# EAGLE design NTP GPS V1.0 (EAGLE 7.7.0)
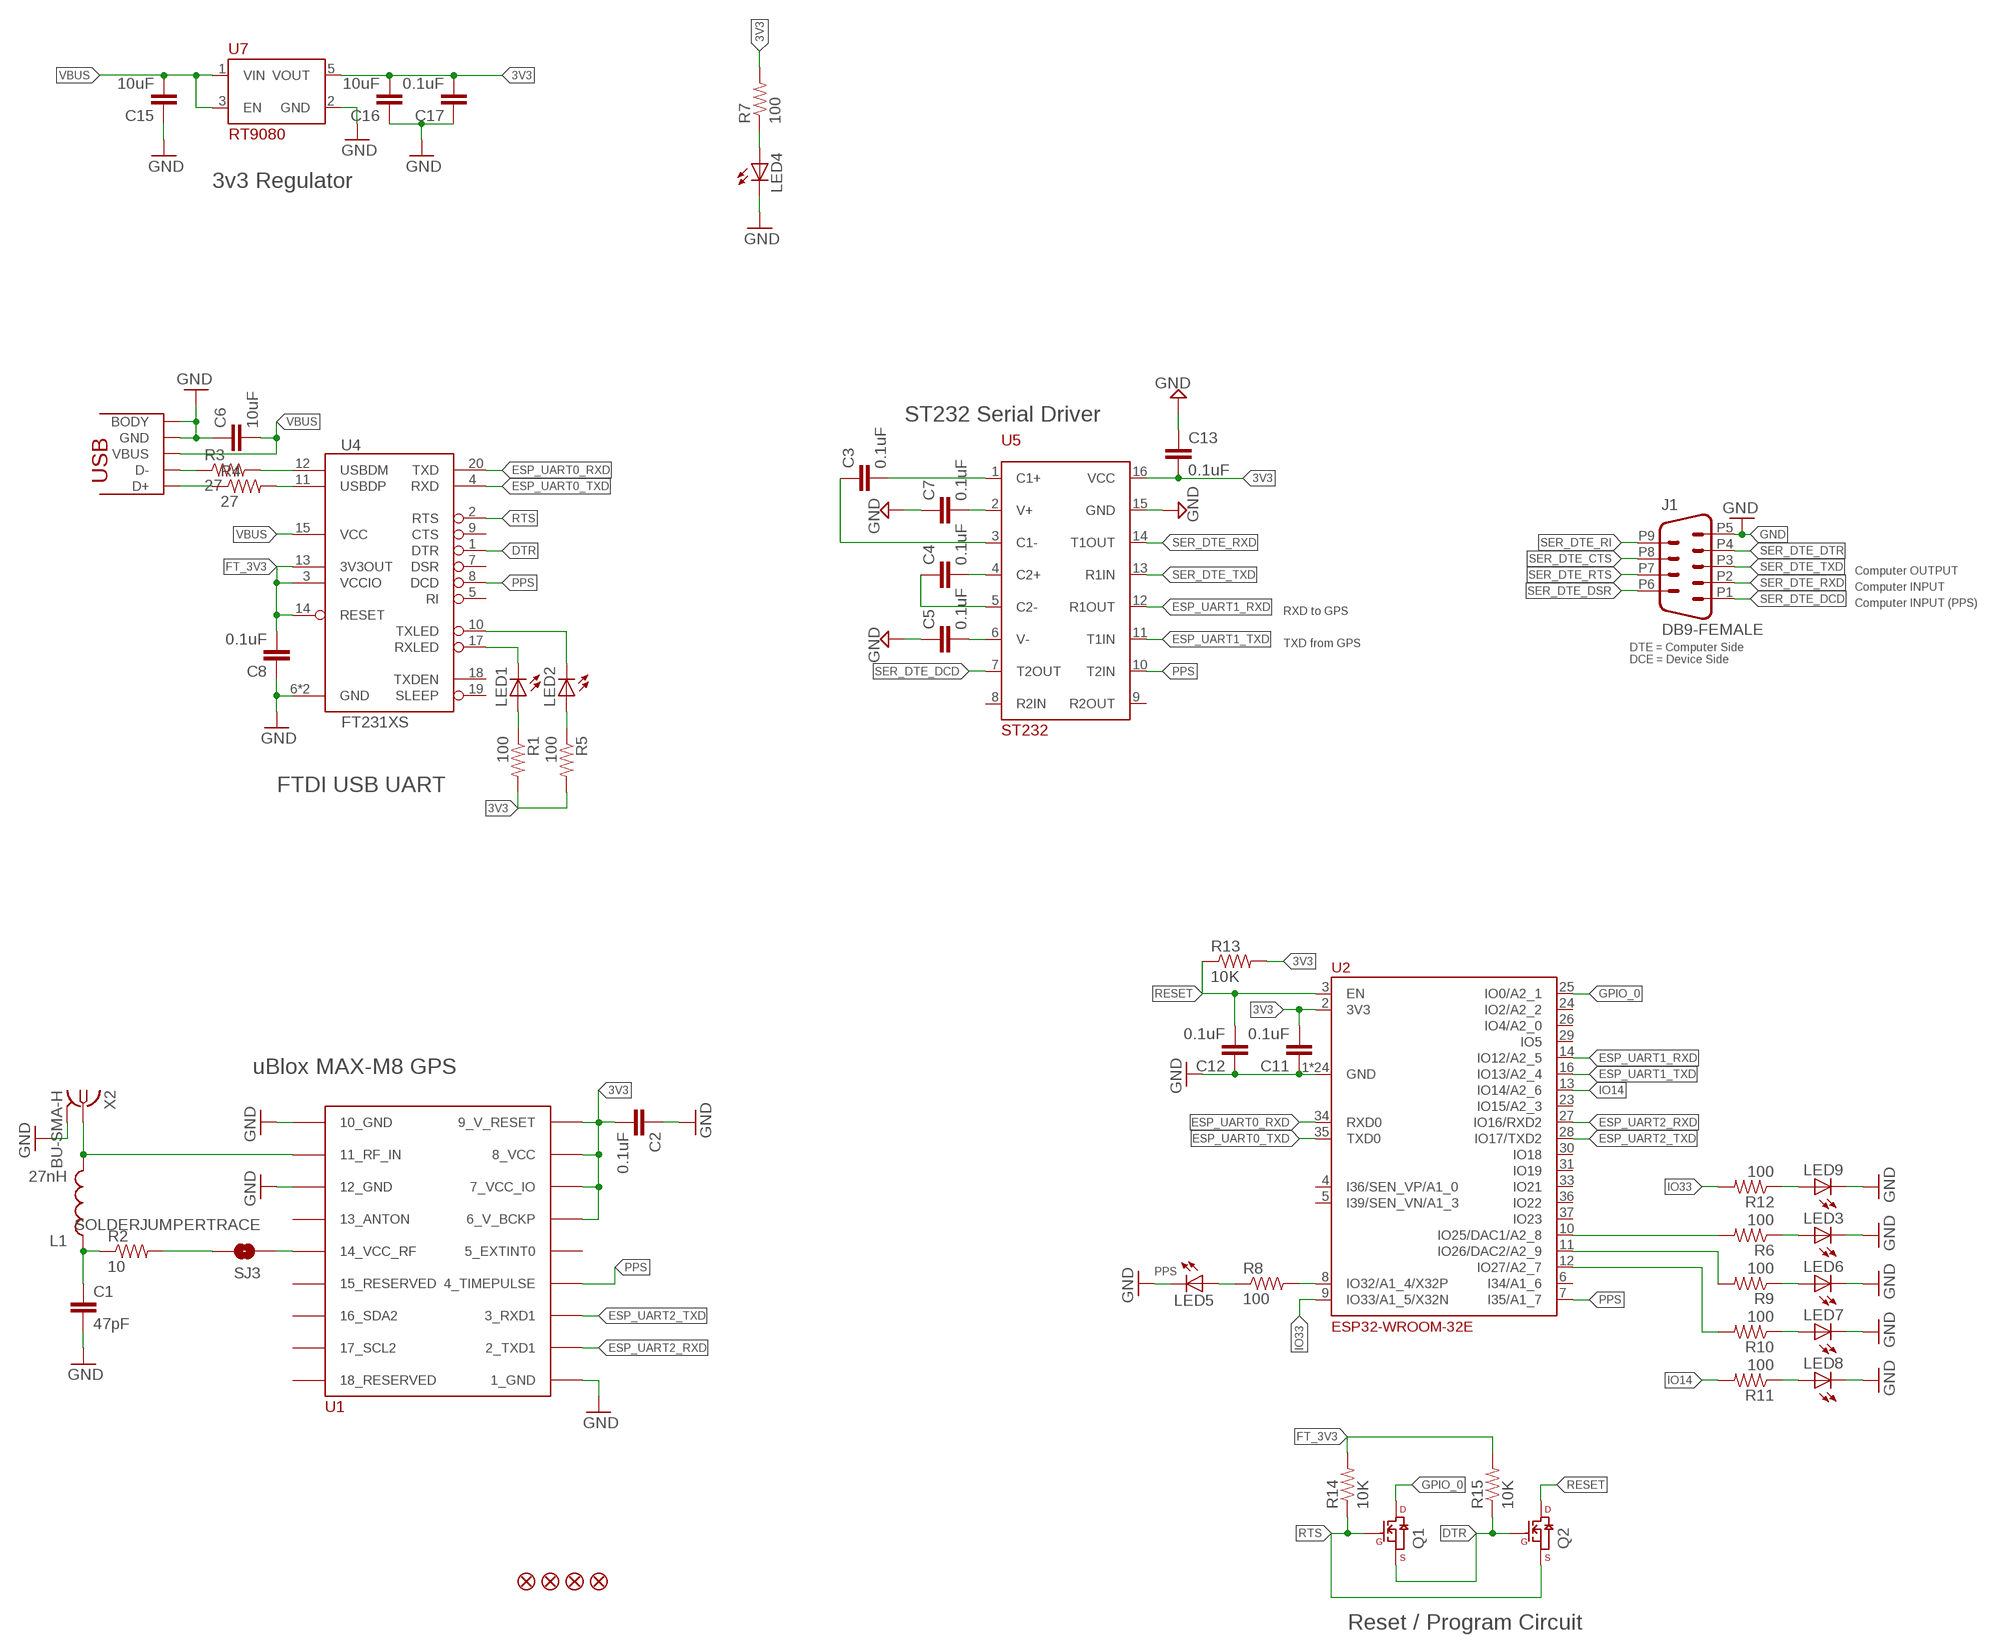
[diagram p0: schematic, sheet 1]

## Parts
C1  47pF  CAP0603-CAP  [0603-CAP]
C2  0.1uF  CAP0603-CAP  [0603-CAP]
C3  0.1uF  CAP0603-CAP  [0603-CAP]
C4  0.1uF  CAP0603-CAP  [0603-CAP]
C5  0.1uF  CAP0603-CAP  [0603-CAP]
C6  10uF  CAP1206  [1206]
C7  0.1uF  CAP0603-CAP  [0603-CAP]
C8  0.1uF  CAP0603-CAP  [0603-CAP]
C11  0.1uF  CAP0603-CAP  [0603-CAP]
C12  0.1uF  CAP0603-CAP  [0603-CAP]
C13  0.1uF  CAP0603-CAP  [0603-CAP]
C15  10uF  CAP1206  [1206]
C16  10uF  CAP1206  [1206]
C17  0.1uF  CAP0603-CAP  [0603-CAP]
FID1  FIDUCIAL  [FIDUCIAL]
FID2  FIDUCIAL  [FIDUCIAL]
FID3  FIDUCIAL  [FIDUCIAL]
FID4  FIDUCIAL  [FIDUCIAL]
J1  DB9-FEMALE  [AMP_DELTAD_D09S13B4GV00LF]
L1  27nH  INDUCTOR0603  [0603]
LED1  LED  [LED_QBL7XX80D-MP4A]
LED2  LED  [LED_QBL7XX80D-MP4A]
LED3  LED  [LED_QBL7XX80D-MP4A]
LED4  LED  [LED_QBL7XX80D-MP4A]
LED5  LED  [LED_QBL7XX80D-MP4A]
LED6  LED  [LED_QBL7XX80D-MP4A]
LED7  LED  [LED_QBL7XX80D-MP4A]
LED8  LED  [LED_QBL7XX80D-MP4A]
LED9  LED  [LED_QBL7XX80D-MP4A]
Q1  MOSFET_N_CHANNELSI1308  [SC-70-3]
Q2  MOSFET_N_CHANNELSI1308  [SC-70-3]
R1  100  RESISTOR0603-RES  [0603-RES]
R2  10  RESISTOR0603-RES  [0603-RES]
R3  27  RESISTOR0603-RES  [0603-RES]
R4  27  RESISTOR0603-RES  [0603-RES]
R5  100  RESISTOR0603-RES  [0603-RES]
R6  100  RESISTOR0603-RES  [0603-RES]
R7  100  RESISTOR0603-RES  [0603-RES]
R8  100  RESISTOR0603-RES  [0603-RES]
R9  100  RESISTOR0603-RES  [0603-RES]
R10  100  RESISTOR0603-RES  [0603-RES]
R11  100  RESISTOR0603-RES  [0603-RES]
R12  100  RESISTOR0603-RES  [0603-RES]
R13  10K  RESISTOR0603-RES  [0603-RES]
R14  10K  RESISTOR0603-RES  [0603-RES]
R15  10K  RESISTOR0603-RES  [0603-RES]
SJ3  SOLDERJUMPERTRACE  [SJ_2S-TRACE]
U1  UBLOX_MAX  [UBLOX_MAX]
U2  ESP32-WROOM-32E  [ESP32-WROOM-32E]
U4  FT231XS  [SSOP-20]
U5  ST232  [SSOP-16]
U7  RT9080  [SOT-23-5]
U$1  USB-MICROB  [USB-MICROB-10118192]
X2  BU-SMA-H  [BU-SMA-H]

## Nets
3V3: C2.2 C11.2 C13.2 C16.2 C17.2 R1.2 R5.2 R7.2 R13.2 U1.6_V_BCKP U1.7_VCC_IO U1.8_VCC U1.9_V_RESET U2.2(3V3) U5.16(VCC) U7.5(VOUT)
DTR: Q1.P$2(S) Q2.P$1(G) R15.1 U4.1(DTR)
ESP_UART0_RXD: U2.34(RXD0) U4.20(TXD)
ESP_UART0_TXD: U2.35(TXD0) U4.4(RXD)
ESP_UART1_RXD: U2.14(IO12/A2_5) U5.12(R1OUT)
ESP_UART1_TXD: U2.16(IO13/A2_4) U5.11(T1IN)
ESP_UART2_RXD: U1.2_TXD1 U2.27(IO16/RXD2)
ESP_UART2_TXD: U1.3_RXD1 U2.28(IO17/TXD2)
FT_3V3: C8.2 R14.2 R15.2 U4.3(VCCIO) U4.13(3V3OUT) U4.14(RESET)
GND: C1.2 C2.1 C5.1 C6.1 C7.1 C8.1 C11.1 C12.1 C13.1 C15.1 C16.1 C17.1 J1.P5 LED3.C LED4.C LED5.C LED6.C LED7.C LED8.C LED9.C U1.1_GND U1.10_GND U1.12_GND U2.1(GND) U2.15(GND) U2.38(GND) U2.P$1(GND) U2.P$2(GND) U2.P$3(GND) U2.P$4(GND) U2.P$5(GND) U2.P$6(GND) U2.P$7(GND) U2.P$8(GND) U2.P$9(GND) U2.P$10(GND) U2.P$11(GND) U2.P$12(GND) U2.PAD@1(GND) U2.PAD@2(GND) U2.PAD@3(GND) U2.PAD@4(GND) U2.PAD@5(GND) U2.PAD@6(GND) U2.PAD@7(GND) U2.PAD@8(GND) U2.PAD@9(GND) U4.6(GND) U4.16(GND) U5.15(GND) U7.2(GND) U$1.5(GND) U$1.BODY@1(BODY) U$1.BODY@2(BODY) U$1.BODY@3(BODY) U$1.BODY@4(BODY) U$1.BODY@5(BODY) U$1.BODY@6(BODY) X2.2 X2.3 X2.4 X2.5
GPIO_0: Q1.P$3(D) U2.25(IO0/A2_1)
IO14: R11.2 U2.13(IO14/A2_6)
IO33: R12.2 U2.9(IO33/A1_5/X32N)
N$1: L1.2 U1.11_RF_IN X2.1
N$2: R8.2 U2.8(IO32/A1_4/X32P)
N$3: SJ3.1 U1.14_VCC_RF
N$4: C1.1 L1.1 R2.1
N$5: C7.2 U5.2(V+)
N$6: C5.2 U5.6(V-)
N$7: R3.1 U$1.2(D-)
N$8: R4.1 U$1.3(D+)
N$9: LED2.A R5.1
N$10: C3.2 U5.1(C1+)
N$11: LED3.A R6.1
N$12: C4.2 U5.4(C2+)
N$13: LED1.C U4.17(RXLED)
N$14: C3.1 U5.3(C1-)
N$15: C4.1 U5.5(C2-)
N$16: LED2.C U4.10(TXLED)
N$17: R4.2 U4.11(USBDP)
N$18: R3.2 U4.12(USBDM)
N$19: R2.2 SJ3.2
N$20: LED4.A R7.1
N$21: LED5.A R8.1
N$22: LED1.A R1.1
N$23: LED6.A R9.1
N$24: LED7.A R10.1
N$25: LED8.A R11.1
N$26: LED9.A R12.1
N$27: R6.2 U2.10(IO25/DAC1/A2_8)
N$28: R9.2 U2.11(IO26/DAC2/A2_9)
N$29: R10.2 U2.12(IO27/A2_7)
PPS: U1.4_TIMEPULSE U2.7(I35/A1_7) U4.8(DCD) U5.10(T2IN)
RESET: C12.2 Q2.P$3(D) R13.1 U2.3(EN)
RTS: Q1.P$1(G) Q2.P$2(S) R14.1 U4.2(RTS)
SER_DTE_CTS: J1.P8
SER_DTE_DCD: J1.P1 U5.7(T2OUT)
SER_DTE_DSR: J1.P6
SER_DTE_DTR: J1.P4
SER_DTE_RI: J1.P9
SER_DTE_RTS: J1.P7
SER_DTE_RXD: J1.P2 U5.14(T1OUT)
SER_DTE_TXD: J1.P3 U5.13(R1IN)
VBUS: C6.2 C15.2 U4.15(VCC) U7.1(VIN) U7.3(EN) U$1.1(VBUS)
Unconnected: U1.5_EXTINT0 U1.13_ANTON U1.15_RESERVED U1.16_SDA2 U1.17_SCL2 U1.18_RESERVED U2.4(I36/SEN_VP/A1_0) U2.5(I39/SEN_VN/A1_3) U2.6(I34/A1_6) U2.23(IO15/A2_3) U2.24(IO2/A2_2) U2.26(IO4/A2_0) U2.29(IO5) U2.30(IO18) U2.31(IO19) U2.33(IO21) U2.36(IO22) U2.37(IO23) U4.5(RI) U4.7(DSR) U4.9(CTS) U4.18(TXDEN) U4.19(SLEEP) U5.8(R2IN) U5.9(R2OUT)

## Notes on the sheet
- 3v3 Regulator
- ST232 Serial Driver
- Computer OUTPUT
- Computer INPUT
- Computer INPUT (PPS)
- RXD to GPS
- TXD from GPS
- DTE = Computer Side
  DCE = Device Side
- FTDI USB UART
- uBlox MAX-M8 GPS
- PPS
- Reset / Program Circuit

## Library data of the parts
C1-C8 C11-C13 C15-C17 = SparkFun:CAP: Capacitor Standard 0603 ceramic capacitor, and 0.1" leaded capacitor.
FID1-FID4 = Nigel:FIDUCIAL
J1 = Nigel:DB9-FEMALE
L1 = SparkFun:INDUCTOR: Inductors Basic Inductor/Choke - 0603 and 1206. Footprints are not proven and vary greatly between part numbers.
LED1-LED9 = Nigel:LED
Q1 Q2 = Nigel:MOSFET_N_CHANNEL: N-Channel MOSFET
R1-R15 = SparkFun:RESISTOR: Resistor Basic schematic elements and footprints for 0603, 1206, and PTH resistors.
SJ3 = SparkFun:SOLDERJUMPER: Solder Jumper Standard SMD solder jumper. Used to automate production. Two varients : Normally Open and Normally Closed are the same, but have different paste layers. NC will have a large amount of paste and should jumper during reflow.
U1 = Ava:UBLOX_MAX: UBLOX MAX
U2 = Nigel:ESP32-WROOM-32E: ESP32-WROOM-32E
U4 = Nigel:FT231XS: FT231XS USB to Full Handshake UART
U5 = Nigel:ST232: RS-232 Driver/Reciever 5V Supply
U7 = Nigel:RT9080: RT9080 Low Quiescent Current LDO Linear Regulator
U$1 = Nigel:USB: USB Micro B Connector Ampehnol Part 10118192-0001LF
X2 = con-coax:BU-SMA-H: FEMALE SMA CONNECTOR Radiall; OC_FARNELL: unknown; OC_NEWARK: unknown

## Board
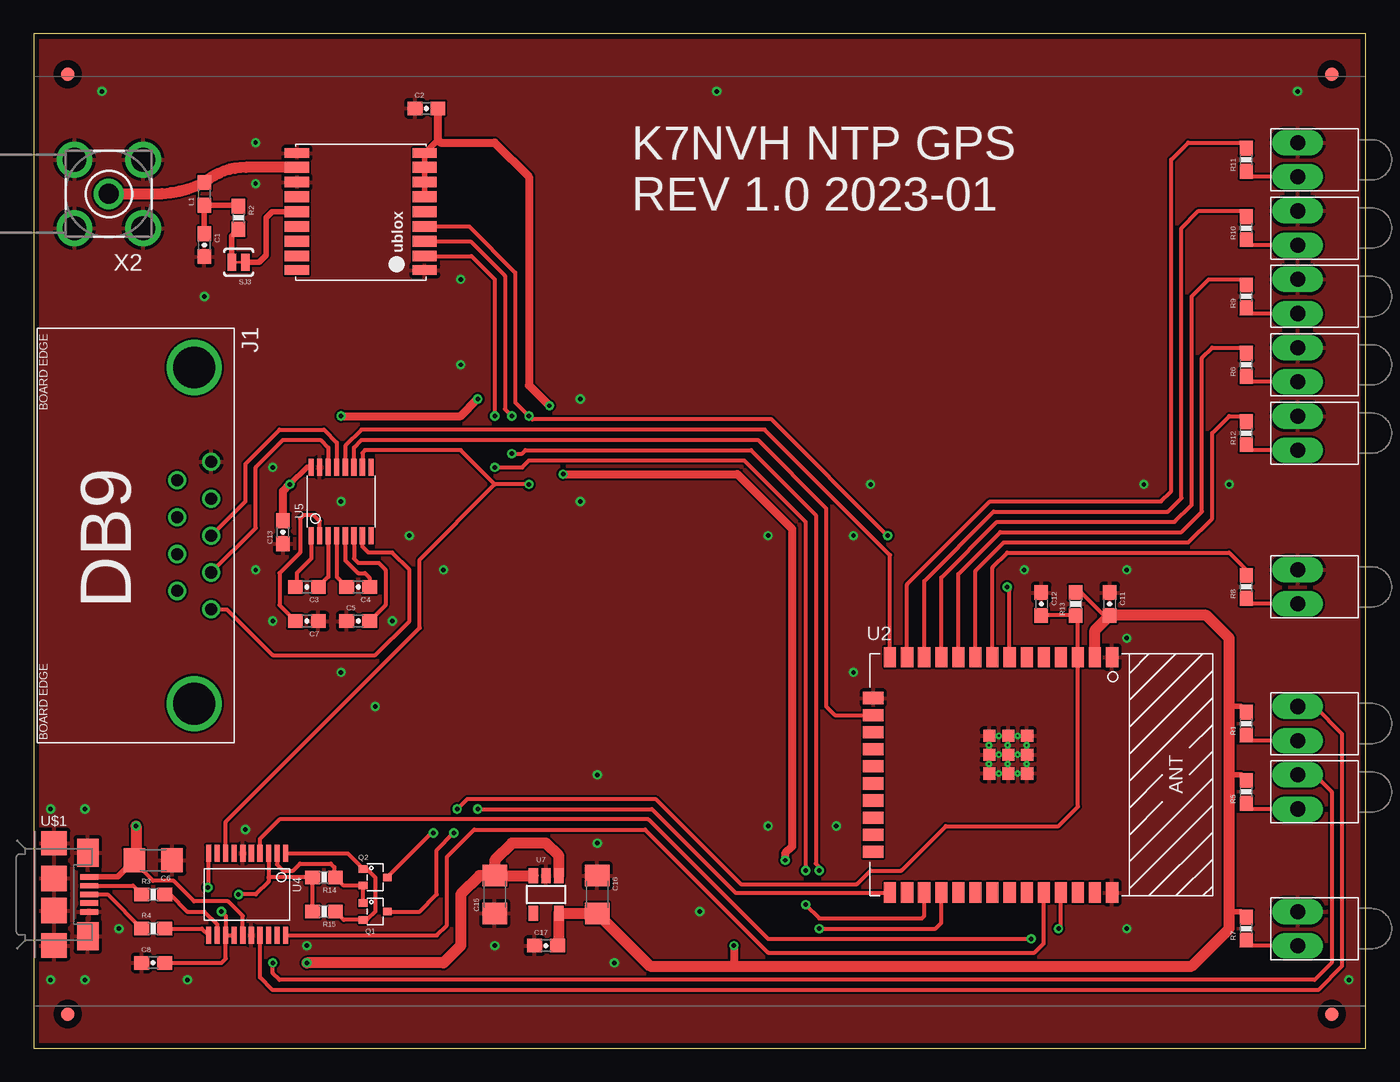
[diagram p1: board, top side]
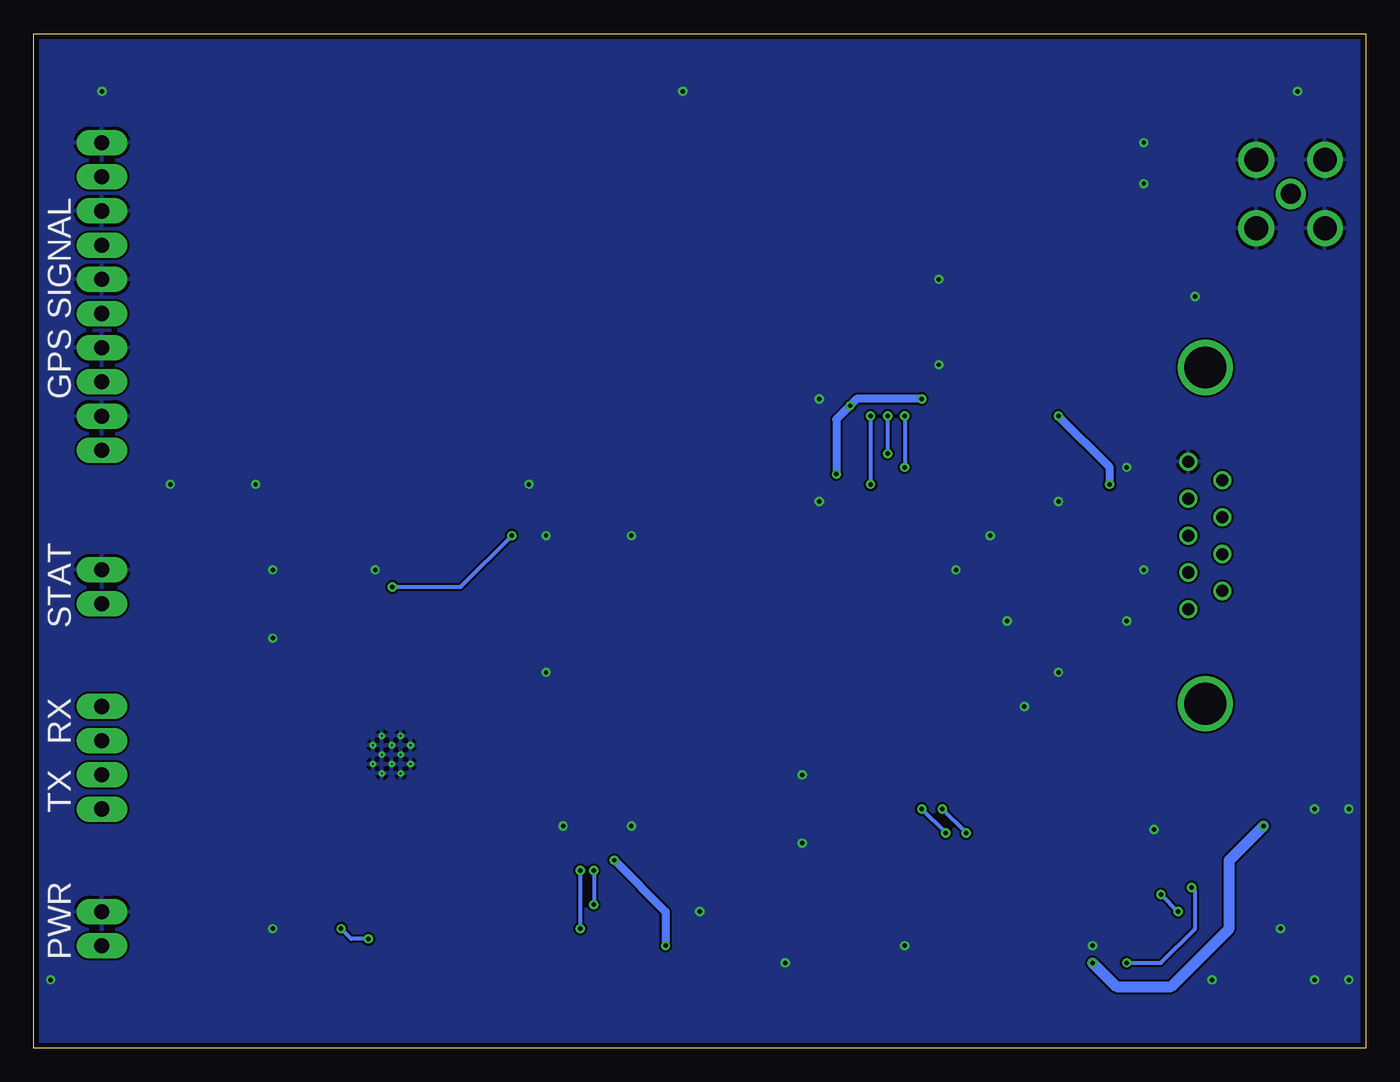
[diagram p2: board, bottom side, seen from below]

Size 99.06 x 75.41 mm. Coordinates in mm from the lower left corner, seen from the top.
Outline: 0,0 99.06,0 99.06,75.41 0,75.41 0,0
Copper layers (1*16): Top 0.0356mm / dielectric 1.5011mm / Bottom 0.0356mm
Design rules "LaenPCBOrder": minimum track width 6mil, minimum drill 13mil, track to track 6mil, track to pad 6mil, pad to pad 6mil, via to via 6mil, smd to smd 6mil, copper to edge 15mil, drill to drill 6mil, minimum pad ring 7mil, minimum via ring 7mil, stop-mask expansion 3mil, vias tented up to drill 0mil, thermal gap 10mil

### Footprints (pad centres in the part's own frame; a part is rotated, then mirrored left to right if it is on the bottom)
0603-CAP = smd 1.1 x 1: 1 -0.85,0; 2 0.85,0
1206 = smd 1.6 x 1.8: 1 -1.4,0; 2 1.4,0
FIDUCIAL = smd 1 x 1: 1 0,0
AMP_DELTAD_D09S13B4GV00LF = drill 0.9: P1 5.48,1.27; P2 2.74,1.27; P3 0,1.27; P4 -2.74,1.27; P5 -5.48,1.27; P6 4.11,-1.27; P7 1.37,-1.27; P8 -1.37,-1.27; P9 -4.11,-1.27 | drill 3.1: SHELL@1 -12.495,0; SHELL@2 12.495,0
0603 = smd 1.1 x 1: 1 -0.85,0; 2 0.85,0
LED_QBL7XX80D-MP4A = drill 1.118 pad 1.88 long: A -1.27,0; C 1.27,0
SC-70-3 = smd 0.558 x 0.648: P$1 -0.622,-0.895; P$2 0.622,-0.895; P$3 0,0.895
0603-RES = smd 1.1 x 1: 1 -0.85,0; 2 0.85,0
SJ_2S-TRACE = smd 0.635 x 1.27: 1 -0.508,0; 2 0.508,0
UBLOX_MAX = smd 1.8 x 0.7: 1_GND 4.95,-4.4; 9_V_RESET 4.95,4.3; 10_GND -4.55,4.3; 18_RESERVED -4.55,-4.4 | smd 1.8 x 0.8: 2_TXD1 4.95,-3.35; 3_RXD1 4.95,-2.25; 4_TIMEPULSE 4.95,-1.15; 5_EXTINT0 4.95,-0.05; 6_V_BCKP 4.95,1.05; 7_VCC_IO 4.95,2.15; 8_VCC 4.95,3.25; 11_RF_IN -4.55,3.25; 12_GND -4.55,2.15; 13_ANTON -4.55,1.05; 14_VCC_RF -4.55,-0.05; 15_RESERVED -4.55,-1.15; 16_SDA2 -4.55,-2.25; 17_SCL2 -4.55,-3.35
ESP32-WROOM-32E = smd 1.5 x 0.9: 1 -8.75,5.26; 2 -8.75,3.99; 3 -8.75,2.72; 4 -8.75,1.45; 5 -8.75,0.18; 6 -8.75,-1.09; 7 -8.75,-2.36; 8 -8.75,-3.63; 9 -8.75,-4.9; 10 -8.75,-6.17; 11 -8.75,-7.44; 12 -8.75,-8.71; 13 -8.75,-9.98; 14 -8.75,-11.25; 25 8.75,-11.25; 26 8.75,-9.98; 27 8.75,-8.71; 28 8.75,-7.44; 29 8.75,-6.17; 30 8.75,-4.9; 31 8.75,-3.63; 32 8.75,-2.36; 33 8.75,-1.09; 34 8.75,0.18; 35 8.75,1.45; 36 8.75,2.72; 37 8.75,3.99; 38 8.75,5.26 | smd 0.9 x 1.5: 15 -5.71,-12.5; 16 -4.44,-12.5; 17 -3.17,-12.5; 18 -1.9,-12.5; 19 -0.63,-12.5; 20 0.64,-12.5; 21 1.91,-12.5; 22 3.18,-12.5; 23 4.45,-12.5; 24 5.72,-12.5 | drill 0.13 pad 0.4: P$1 -0.8,-2.5; P$2 -2.2,-2.5; P$3 -2.2,-1.1; P$4 -0.8,-1.1; P$5 -2.2,-3.9; P$6 -0.8,-3.9; P$7 -2.9,-1.76; P$8 -1.5,-1.76; P$9 -0.1,-1.76; P$10 -1.5,-3.16; P$11 -2.9,-3.16; P$12 -0.1,-3.16 | smd 0.9 x 0.9: PAD@1 -1.5,-2.46; PAD@2 -0.1,-2.46; PAD@3 -0.1,-3.86; PAD@4 -1.5,-3.86; PAD@5 -2.9,-3.86; PAD@6 -2.9,-2.46; PAD@7 -2.9,-1.06; PAD@8 -1.5,-1.06; PAD@9 -0.1,-1.06
SSOP-20 = smd 0.381 x 1.27: 1 -2.223,-3.048; 2 -1.587,-3.048; 3 -0.953,-3.048; 4 -0.318,-3.048; 5 0.318,-3.048; 6 0.953,-3.048; 7 1.587,-3.048; 8 2.223,-3.048; 9 2.857,-3.048; 10 3.493,-3.048; 11 3.493,3.048; 12 2.857,3.048; 13 2.223,3.048; 14 1.587,3.048; 15 0.953,3.048; 16 0.318,3.048; 17 -0.318,3.048; 18 -0.953,3.048; 19 -1.587,3.048; 20 -2.223,3.048
SSOP-16 = smd 0.381 x 1.27: 1 -2.223,-2.54; 2 -1.587,-2.54; 3 -0.953,-2.54; 4 -0.318,-2.54; 5 0.318,-2.54; 6 0.953,-2.54; 7 1.587,-2.54; 8 2.223,-2.54; 9 2.223,2.54; 10 1.587,2.54; 11 0.953,2.54; 12 0.318,2.54; 13 -0.318,2.54; 14 -0.953,2.54; 15 -1.587,2.54; 16 -2.223,2.54
SOT-23-5 = smd 0.7 x 1.1: 1 -0.95,-1.4; 2 0,-1.4; 3 0.95,-1.4; 4 0.95,1.4; 5 -0.95,1.4
USB-MICROB-10118192 = smd 0.4 x 1.35: 1 -1.3,2.6; 2 -0.65,2.6; 3 0,2.6; 4 0.65,2.6; 5 1.3,2.6 | smd 1.8 x 1.9: BODY@1 -3.8,0; BODY@4 3.8,0 | smd 1.9 x 1.9: BODY@2 -1.2,0; BODY@3 1.2,0 | smd 2.1 x 1.6: BODY@5 -3.1,2.5; BODY@6 3.1,2.5
BU-SMA-H = drill 1.499: 1 0,0 | drill 1.778: 2 -2.55,2.55; 3 2.55,2.55; 4 2.55,-2.55; 5 -2.55,-2.55

### Placement (x,y rotation side)
C1  12.7,59.69 270 top
C2  29.21,69.85 0 top
C3  20.32,34.29 180 top
C4  24.13,34.29 180 top
C5  24.13,31.75 0 top
C6  8.89,13.97 180 top
C7  20.32,31.75 180 top
C8  8.89,6.35 0 top
C11  80.01,33.02 270 top
C12  74.93,33.02 270 top
C13  18.54,38.35 90 top
C15  34.29,11.43 90 top
C16  41.91,11.43 270 top
C17  38.1,7.62 0 top
FID1  2.54,2.54 0 top
FID2  96.52,2.54 0 top
FID3  96.52,72.39 0 top
FID4  2.54,72.39 0 top
J1  11.94,38.1 270 top
L1  12.7,63.5 90 top
LED1  93.98,24.13 90 top
LED2  93.98,19.05 90 top
LED3  93.98,50.8 90 top
LED4  93.98,8.89 90 top
LED5  93.98,34.29 90 top
LED6  93.98,55.88 90 top
LED7  93.98,60.96 90 top
LED8  93.98,66.04 90 top
LED9  93.98,45.72 90 top
Q1  25.4,10.16 270 top
Q2  25.4,12.7 270 top
R1  90.17,24.13 90 top
R2  15.24,61.72 270 top
R3  8.89,11.43 0 top
R4  8.89,8.89 0 top
R5  90.17,19.05 90 top
R6  90.17,50.8 90 top
R7  90.17,8.89 90 top
R8  90.17,34.29 90 top
R9  90.17,55.88 90 top
R10  90.17,60.96 90 top
R11  90.17,66.04 90 top
R12  90.17,45.72 90 top
R13  77.47,33.02 90 top
R14  21.59,12.7 180 top
R15  21.59,10.16 180 top
SJ3  15.24,58.42 180 top
U1  24.13,62.23 0 top
U2  74.93,20.32 270 top
U4  16.51,11.43 180 top
U5  22.86,40.64 0 top
U7  38.1,11.43 180 top
U$1  1.52,11.43 270 top
X2  5.59,63.5 180 top

### Tracks (layer width: path | path; a pad name or v marks a point on that pad's centre or on a via)
3V3  (via drill 0.33)
  Top 0.305: C11.2 79.59,32.17 77.89,33.87 R13.2
  Top 0.406: U1.6_V_BCKP U1.7_VCC_IO U1.8_VCC U1.9_V_RESET 30.06,67.51 | R7.2 89.75,10.16 88.9,10.16 | R5.2 89.75,20.32 88.9,20.32 | R1.2 89.75,25.4 88.9,25.4 | U5.16 20.32,43.18 v19.05,41.91
  Top 0.61: v38.35,47.75 36.83,49.28 36.83,64.77 34.29,67.31 30.26,67.31 30.06,67.51 C2.2 | v39.37,42.67 52.32,42.67 56.39,38.61 56.39,14.99 55.88,14.48 v55.88,13.97 | v52.07,7.62 52.07,6.1 | C13.2 18.54,41.4 v19.05,41.91 | v22.86,46.99 31.75,46.99 v33.02,48.26
  Top 0.813: C17.2 39.05,7.72 U7.5 C16.2 45.84,6.1 52.07,6.1 86.11,6.1 88.9,8.89 88.9,10.16 88.9,20.32 88.9,25.4 88.9,30.48 87.21,32.17 C11.2 78.92,31.08 U2.2
  Bottom 0.61: v39.37,42.67 39.37,46.74 v38.35,47.75 37.85,48.26 v33.02,48.26 | v55.88,13.97 52.07,10.16 v52.07,7.62 | v19.05,41.91 19.05,43.18 v22.86,46.99
DTR
  Top 0.305: R15.1 23.06,9.54 Q1.P$2 24.78,9.54 25.4,10.16 25.4,12.7 24.78,13.32 Q2.P$1 23.35,14.48 U4.1
ESP_UART0_RXD
  Top 0.305: U4.20 29.97,8.38 30.73,9.14 30.73,14.22 32.77,16.26 45.47,16.26 54.61,7.11 74.42,7.11 75.11,7.8 U2.34
ESP_UART0_TXD  (via drill 0.33)
  Top 0.305: U4.4 16.83,15.56 18.29,17.02 45.72,17.02 54.61,8.13 v74.17,8.13 | v76.2,8.89 76.38,9.07 U2.35
  Bottom 0.305: v74.17,8.13 75.44,8.13 v76.2,8.89
ESP_UART1_RXD
  Top 0.305: U2.14 63.68,36.65 54.36,45.97 24.38,45.97 23.18,44.77 U5.12
ESP_UART1_TXD
  Top 0.305: U5.11 23.81,44.64 24.38,45.21 53.85,45.21 58.93,40.13 58.93,25.4 59.57,24.76 U2.16
ESP_UART2_RXD  (via drill 0.33)
  Top 0.305: U1.2_TXD1 32.56,58.88 34.29,57.15 v34.29,46.99 | v34.29,43.18 36.32,43.18 36.83,43.69 52.83,43.69 57.4,39.12 v57.4,13.21 | v57.4,10.67 58.42,9.65 66.04,9.65 66.22,9.83 U2.27
  Bottom 0.305: v34.29,46.99 v34.29,43.18 | v57.4,13.21 v57.4,10.67
ESP_UART2_TXD  (via drill 0.33)
  Top 0.305: U1.3_RXD1 32.48,59.98 35.05,57.4 35.05,47.5 v35.56,46.99 | v35.56,44.2 36.32,44.2 36.58,44.45 53.34,44.45 58.17,39.62 58.17,13.72 58.42,13.46 v58.42,13.21 | v58.42,8.89 67.06,8.89 67.49,9.32 U2.28
  Bottom 0.305: v35.56,46.99 v35.56,44.2 | v58.42,13.21 v58.42,8.89
FT_3V3  (via drill 0.33)
  Top 0.305: U4.13 U4.14 | C8.2 13.97,6.35 14.29,6.67 U4.13 | U4.3 17.46,12.7 | 17.46,12.7 17.46,12.38 16.51,11.43 v15.24,11.43 | v13.97,10.16 14.29,9.84 U4.13 | R15.2 R14.2 17.46,12.7
  Bottom 0.305: v15.24,11.43 v13.97,10.16
GND  (via drill 0.33)
  Top 0.305: U2.PAD@1 72.47,22.48 U2.P$2 | U2.PAD@2 72.47,21.08 U2.P$1
  other vias: 17.78,43.18 16.51,35.56 26.67,31.75 41.91,15.24 34.29,7.62 81.28,8.89 81.28,30.48 81.28,35.56 73.66,35.56 15.75,16.26 11.43,5.08 17.78,31.75 22.86,40.64 31.75,57.15 16.51,67.31 16.51,64.26 60.96,27.94 40.64,48.26 40.64,40.64 54.61,38.1 60.96,38.1 62.23,41.91 54.61,16.51 59.69,16.51 41.91,20.32 49.53,10.16 43.18,6.35 20.32,7.62 1.27,5.08 1.27,17.78 3.81,5.08 3.81,17.78 6.35,8.89 97.79,5.08 82.55,41.91 88.9,41.91 93.98,71.12 50.8,71.12 5.08,71.12 27.94,38.1 30.48,35.56 22.86,27.94 25.4,25.4 31.75,50.8 12.7,55.88
  pour Bottom: 0,0 99.06,0 99.06,75.41 0,75.41
  pour Top: 0,0 99.06,0 99.06,75.41 0,75.41
GPIO_0  (via drill 0.33)
  Top 0.305: Q1.P$3 28.7,10.16 29.97,11.43 29.97,14.73 v31.24,16 | v33.02,17.78 45.97,17.78 52.18,11.57 U2.25
  Bottom 0.305: v31.24,16 v33.02,17.78
IO14
  Top 0.305: U2.13 64.95,34.47 71.12,40.64 83.82,40.64 84.58,41.4 84.58,66.04 85.85,67.31 89.75,67.31 R11.2
IO33
  Top 0.305: U2.9 70.03,35.49 72.14,37.59 85.85,37.59 87.63,39.37 87.63,45.72 88.9,46.99 89.75,46.99 R12.2
N$1
  Top 0.813: X2.1 8.89,63.5 arc25 L1.2 arc-40 15.8,65.48 U1.11_RF_IN
N$2
  Top 0.305: U2.8 71.3,35.74 72.39,36.83 88.9,36.83 90.17,35.56 R8.2
N$3
  Top 0.406: U1.14_VCC_RF 17.73,62.18 17.27,61.72 17.27,58.93 16.76,58.42 SJ3.1
N$4
  Top 0.406: C1.1 L1.1 15.16,62.65 R2.1
N$5
  Top 0.305: U5.2 21.27,39.18 20.83,39.62 20.07,39.62 19.81,39.37 19.81,36.83 18.29,35.31 18.29,32.93 C7.2
N$6
  Top 0.305: U5.6 23.81,36.39 24.13,36.07 25.65,36.07 26.16,35.56 26.16,32.93 C5.2
N$7
  Top 0.305: U$1.2 7.39,12.08 R3.1
N$8
  Top 0.305: U$1.3 5.5,11.43 R4.1
N$9
  Top 0.305: LED2.A 90.59,17.78 R5.1
N$10
  Top 0.305: U5.1 20.64,36.39 19.56,35.31 19.56,34.38 C3.2
N$11
  Top 0.305: LED3.A 90.59,49.53 R6.1
N$12
  Top 0.305: U5.4 22.54,35.03 C4.2
N$13
  Top 0.305: LED1.C 95.25,25.4 97.28,23.37 97.28,6.1 95.5,4.32 17.78,4.32 16.83,5.27 U4.17
N$14
  Top 0.305: U5.3 21.91,35.03 C3.1
N$15
  Top 0.305: U5.5 23.18,36.26 24.13,35.31 24.64,35.31 24.98,34.96 C4.1
N$16  (via drill 0.33)
  Top 0.305: LED2.C 95.25,20.32 96.52,19.05 96.52,6.35 95.25,5.08 18.29,5.08 17.78,5.59 v17.78,6.35 | v12.95,11.94 13.02,12 U4.10
  Bottom 0.305: v17.78,6.35 15.24,6.35 12.7,8.89 12.7,11.68 v12.95,11.94
N$17
  Top 0.305: R4.2 12.51,8.89 U4.11
N$18
  Top 0.305: R3.2 10.16,11.43 11.43,10.16 12.7,10.16 13.65,9.21 U4.12
N$19
  Top 0.406: SJ3.2 14.73,60.36 R2.2
N$20
  Top 0.305: LED4.A 90.59,7.62 R7.1
N$21
  Top 0.305: LED5.A 90.59,33.02 R8.1
N$22
  Top 0.305: LED1.A 90.59,22.86 R1.1
N$23
  Top 0.305: LED6.A 90.59,54.61 R9.1
N$24
  Top 0.305: LED7.A 90.59,59.69 R10.1
N$25
  Top 0.305: LED8.A 90.59,64.77 R11.1
N$26
  Top 0.305: LED9.A 90.59,44.45 R12.1
N$27
  Top 0.305: U2.10 68.76,35.23 71.88,38.35 85.34,38.35 86.87,39.88 86.87,51.31 87.63,52.07 89.75,52.07 R6.2
N$28
  Top 0.305: U2.11 67.49,34.98 71.63,39.12 84.84,39.12 86.11,40.39 86.11,55.88 87.38,57.15 89.75,57.15 R9.2
N$29
  Top 0.305: U2.12 66.22,34.72 71.37,39.88 84.33,39.88 85.34,40.89 85.34,60.96 86.61,62.23 89.75,62.23 R10.2
PPS  (via drill 0.33)
  Top 0.305: U1.4_TIMEPULSE 32.39,61.08 35.81,57.66 35.81,48.01 v36.83,46.99 37.08,46.74 54.86,46.74 v63.5,38.1 | v36.83,41.91 34.29,41.91 | 34.29,41.91 31.75,44.45 24.64,44.45 24.45,44.26 U5.10 | U4.8 14.29,16.83 28.7,31.24 28.7,36.32 34.29,41.91 | U2.7 72.57,34.11 v72.39,34.29
  Bottom 0.305: v36.83,46.99 v36.83,41.91 | v72.39,34.29 67.31,34.29 v63.5,38.1
RESET  (via drill 0.33)
  Top 0.305: C12.2 R13.1 77.65,31.99 U2.3 77.65,17.96 76.2,16.51 67.82,16.51 64.52,13.21 62.23,13.21 61.21,12.19 52.58,12.19 46.23,18.54 32.26,18.54 v31.5,17.78 | Q2.P$3 29.6,16 v29.72,16
  Bottom 0.305: v29.72,16 v31.5,17.78
RTS
  Top 0.305: Q1.P$1 Q2.P$2 23.06,12.08 R14.1 22.35,12.79 22.35,13.46 22.1,13.72 19.81,13.72 19.3,13.21 18.54,13.21 18.1,13.65 U4.2
SER_DTE_DCD
  Top 0.305: J1.P1 14.37,32.62 17.78,29.21 25.4,29.21 27.94,31.75 27.94,35.56 26.67,36.83 24.89,36.83 24.45,37.27 U5.7
SER_DTE_RXD
  Top 0.305: J1.P2 16.51,38.66 16.51,43.18 18.54,45.21 21.34,45.21 21.91,44.64 U5.14
SER_DTE_TXD
  Top 0.305: J1.P3 15.75,40.64 15.75,43.43 18.29,45.97 21.59,45.97 22.54,45.02 U5.13
VBUS  (via drill 0.33)
  Top 0.305: U4.15 15.56,9.84 14.48,10.92 11.94,10.92 10.41,12.45 8.89,12.45 7.49,13.85 C6.2
  Top 0.406: U$1.1 6.25,12.73 C6.2
  Top 0.813: C15.2 U7.3 | U7.1 39.05,14.29 38.1,15.24 35.56,15.24 34.29,13.97 C15.2 | C15.2 33.15,12.83 31.75,11.43 31.75,7.62 30.48,6.35 v20.32,6.35 | v7.62,16.51 7.62,14.1 C6.2
  Bottom 0.813: v20.32,6.35 18.54,4.57 14.48,4.57 10.16,8.89 10.16,13.97 v7.62,16.51

### Text on the board
tPlace: K7NVH NTP GPS / REV 1.0 2023-01
bPlace: GPS SIGNAL | STAT | RX | TX | PWR